# EAGLE design pogo_programming_board_v1 (EAGLE 5.11)
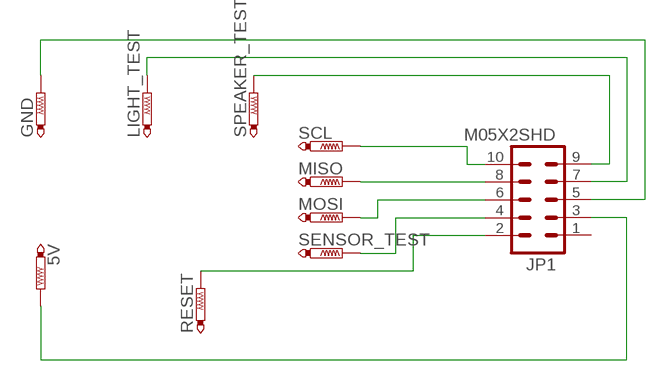
[diagram p0: schematic, sheet 1]

## Parts
5V  PTR1PAD1-13Y  [P1-13Y]
GND  PTR1PAD1-13Y  [P1-13Y]
JP1  M05X2SHD  [2X5-SHROUDED]
LIGHT_TEST  PTR1PAD1-13Y  [P1-13Y]
MISO  PTR1PAD1-13Y  [P1-13Y]
MOSI  PTR1PAD1-13Y  [P1-13Y]
RESET  PTR1PAD1-13Y  [P1-13Y]
SCL  PTR1PAD1-13Y  [P1-13Y]
SENSOR_TEST  PTR1PAD1-13Y  [P1-13Y]
SPEAKER_TEST  PTR1PAD1-13Y  [P1-13Y]

## Nets
N$1: JP1.10 SCL.TP
N$2: JP1.8 MISO.TP
N$3: JP1.6 MOSI.TP
N$4: JP1.4 SENSOR_TEST.TP
N$5: JP1.2 RESET.TP
N$6: 5V.TP JP1.3
N$7: JP1.9 SPEAKER_TEST.TP
N$8: JP1.7 LIGHT_TEST.TP
N$9: GND.TP JP1.5
Unconnected: JP1.1

## Library data of the parts
5V GND LIGHT_TEST MISO MOSI RESET SCL SENSOR_TEST SPEAKER_TEST = testpad:PTR1: TEST PIN
JP1 = SparkFun:M05X2: Header 5x2 Standard 10-pin dual row 0.1" header. Commonly used with AVR-ISP. Use with Spark Fun Electronics SKU: PRT-00778

## Board
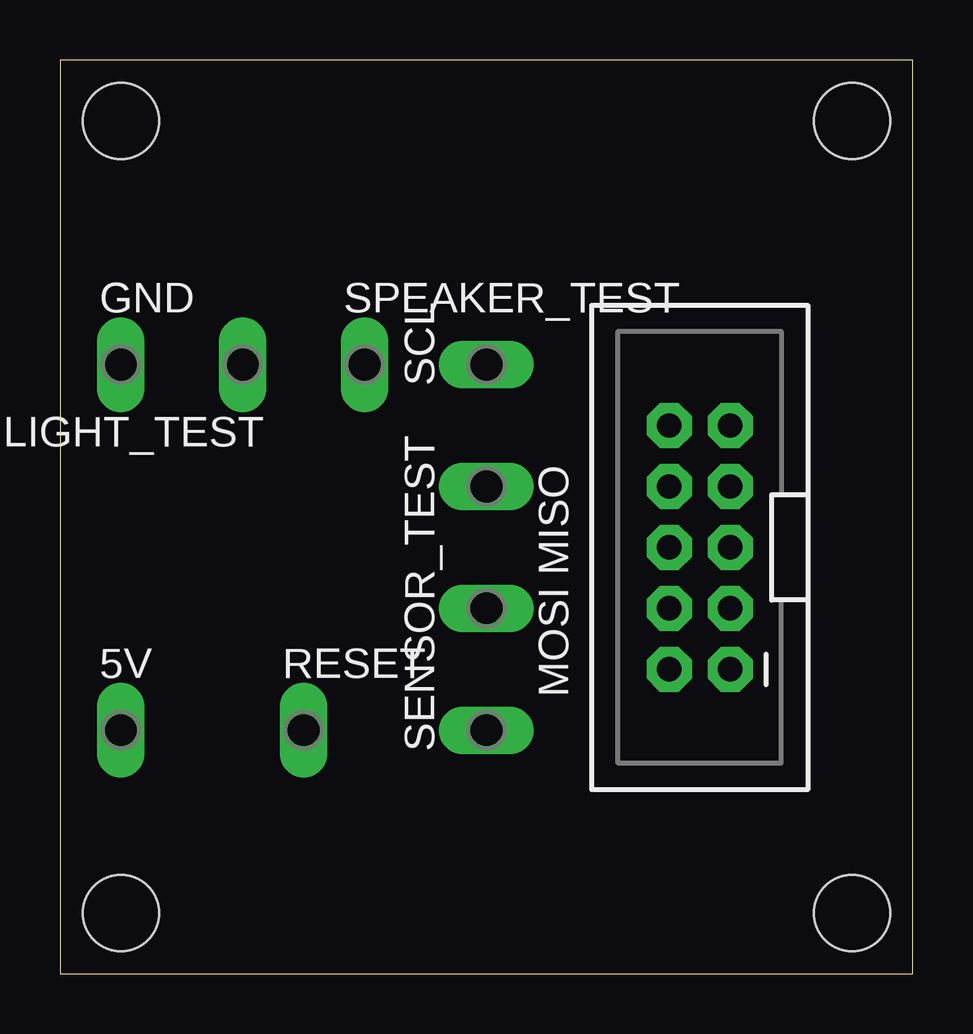
[diagram p1: board, top side]
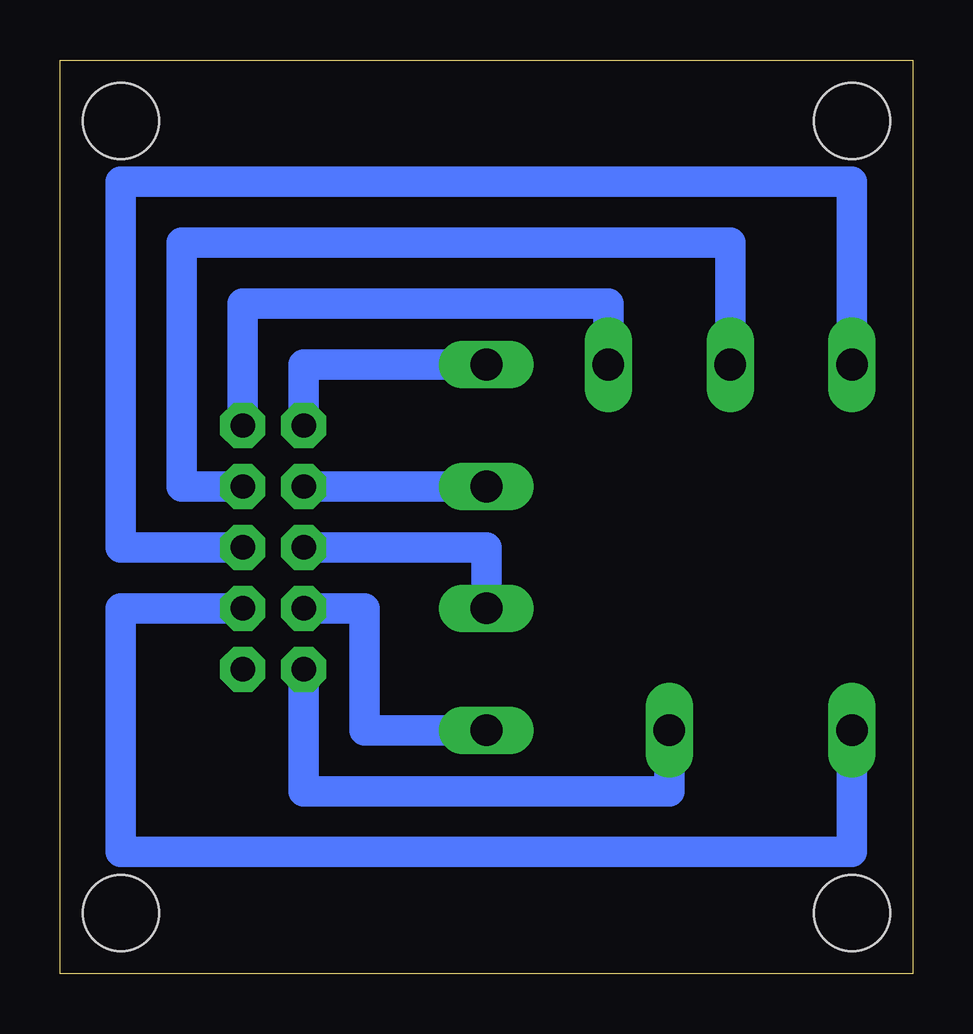
[diagram p2: board, bottom side, seen from below]

Size 35.56 x 38.1 mm. Coordinates in mm from the lower left corner, seen from the top.
Outline: 0,0 35.56,0 35.56,38.1 0,38.1 0,0
Copper layers (1*16): Top 0.035mm / dielectric 1.5mm / Bottom 0.035mm
Design rules "default": minimum track width 10mil, minimum drill 24mil, track to track 8mil, track to pad 8mil, pad to pad 8mil, via to via 8mil, smd to smd 8mil, copper to edge 40mil, drill to drill 8mil, minimum pad ring 10mil, minimum via ring 8mil, stop-mask expansion 4mil, vias tented up to drill 0mil, thermal gap 10mil
Holes 3.17 mm at 2.54,2.54 2.54,35.56 33.02,2.54 33.02,35.56

### Footprints (pad centres in the part's own frame; a part is rotated, then mirrored left to right if it is on the bottom)
P1-13Y = drill 1.321 pad 1.905 long: TP 0,0
2X5-SHROUDED = drill 1.016 pad 1.88 octagon: 1 -1.27,5.08; 2 1.27,5.08; 3 -1.27,2.54; 4 1.27,2.54; 5 -1.27,0; 6 1.27,0; 7 -1.27,-2.54; 8 1.27,-2.54; 9 -1.27,-5.08; 10 1.27,-5.08

### Placement (x,y rotation side)
5V  2.54,10.16 0 top
GND  2.54,25.4 0 top
JP1  26.67,17.78 180 top
LIGHT_TEST  7.62,25.4 180 top
MISO  17.78,20.32 270 top
MOSI  17.78,15.24 270 top
RESET  10.16,10.16 0 top
SCL  17.78,25.4 90 top
SENSOR_TEST  17.78,10.16 90 top
SPEAKER_TEST  12.7,25.4 0 top

### Tracks (layer width: path | path; a pad name or v marks a point on that pad's centre or on a via)
N$1
  Bottom 1.27: SCL.TP 25.4,25.4 JP1.10
N$2
  Bottom 1.27: MISO.TP JP1.8
N$3
  Bottom 1.27: MOSI.TP 17.78,17.78 JP1.6
N$4
  Bottom 1.27: SENSOR_TEST.TP 22.86,10.16 22.86,15.24 JP1.4
N$5
  Bottom 1.27: RESET.TP 10.16,7.62 25.4,7.62 JP1.2
N$6
  Bottom 1.27: 5V.TP 2.54,5.08 33.02,5.08 33.02,15.24 JP1.3
N$7
  Bottom 1.27: SPEAKER_TEST.TP 12.7,27.94 27.94,27.94 JP1.9
N$8
  Bottom 1.27: LIGHT_TEST.TP 7.62,30.48 30.48,30.48 30.48,20.32 JP1.7
N$9
  Bottom 1.27: GND.TP 2.54,33.02 33.02,33.02 33.02,17.78 JP1.5